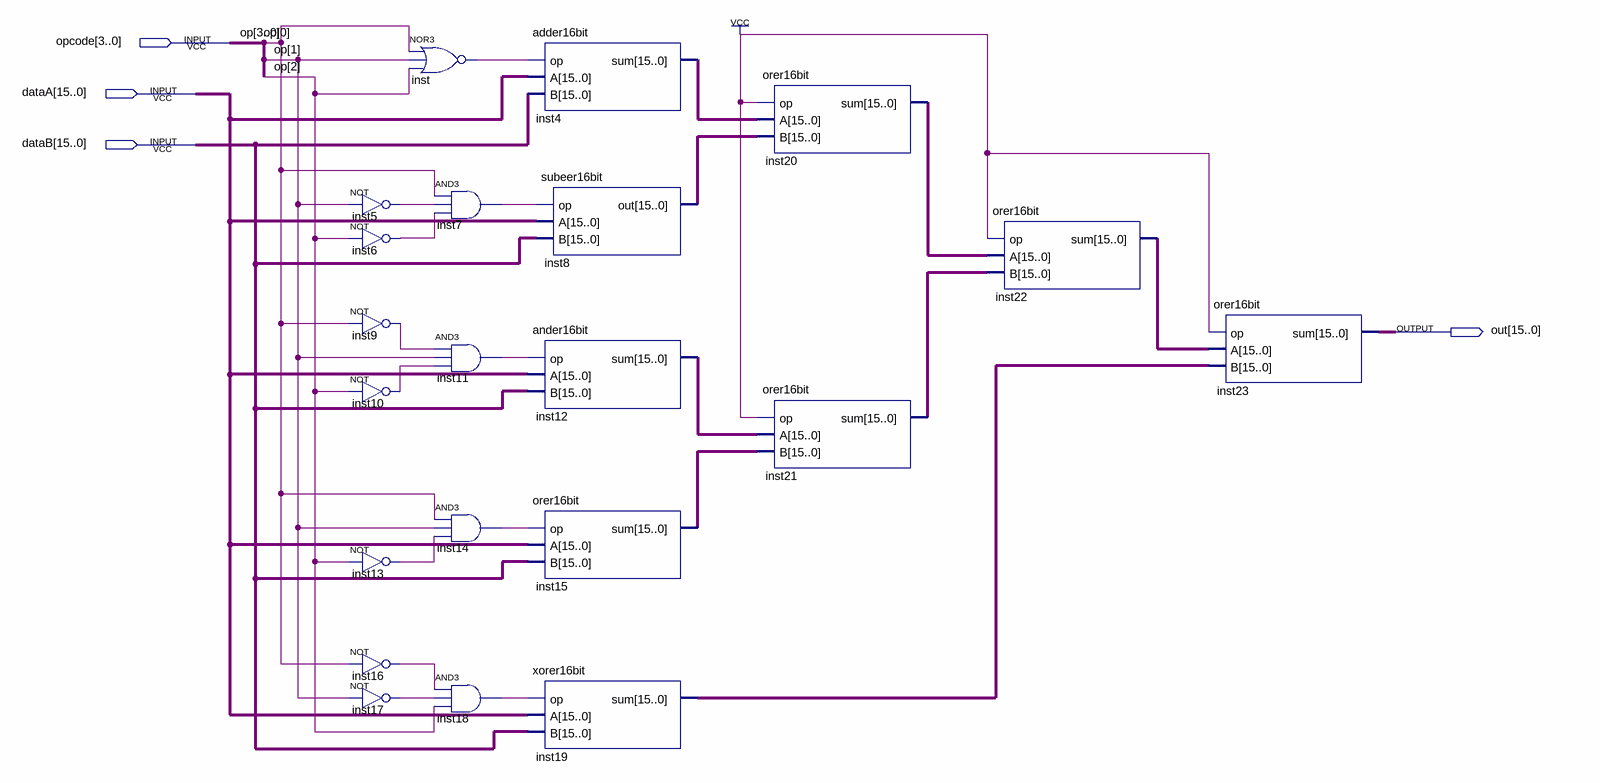
[diagram p0: schematic sheet]
// Quartus schematic ALU.bdf as structural Verilog: 21 symbols, 4 pins
module ALU (
  input  [3:0] opcode,
  input  [15:0] dataA,
  input  [15:0] dataB,
  output [15:0] out
);

  wire inst5_out, inst6_out, inst7_out, inst9_out, inst10_out, inst11_out, inst13_out, inst14_out,
       inst16_out, inst17_out, inst18_out, inst_out;
  wire [15:0] inst4_sum, inst8_out, inst12_sum, inst15_sum, inst19_sum, inst20_sum, inst21_sum, inst22_sum;

  not inst5 (inst5_out, opcode[1]);
  not inst6 (inst6_out, opcode[2]);
  not inst9 (inst9_out, opcode[0]);
  not inst10 (inst10_out, opcode[2]);
  not inst13 (inst13_out, opcode[2]);
  not inst16 (inst16_out, opcode[0]);
  not inst17 (inst17_out, opcode[1]);
  nor inst (inst_out, opcode[0], opcode[1], opcode[2]);
  and inst7 (inst7_out, opcode[0], inst5_out, inst6_out);
  and inst11 (inst11_out, inst9_out, opcode[1], inst10_out);
  and inst14 (inst14_out, opcode[0], opcode[1], inst13_out);
  and inst18 (inst18_out, inst16_out, inst17_out, opcode[2]);
  adder16bit inst4 (.op(inst_out), .A(dataA), .B(dataB), .sum(inst4_sum));
  subeer16bit inst8 (.op(inst7_out), .A(dataA), .B(dataB), .out(inst8_out));
  ander16bit inst12 (.op(inst11_out), .A(dataA), .B(dataB), .sum(inst12_sum));
  orer16bit inst15 (.op(inst14_out), .A(dataA), .B(dataB), .sum(inst15_sum));
  xorer16bit inst19 (.op(inst18_out), .A(dataA), .B(dataB), .sum(inst19_sum));
  orer16bit inst20 (.op(1'b1), .A(inst4_sum), .B(inst8_out), .sum(inst20_sum));
  orer16bit inst21 (.op(1'b1), .A(inst12_sum), .B(inst15_sum), .sum(inst21_sum));
  orer16bit inst22 (.op(1'b1), .A(inst20_sum), .B(inst21_sum), .sum(inst22_sum));
  orer16bit inst23 (.op(1'b1), .A(inst22_sum), .B(inst19_sum), .sum(out));

  // Other names for the same wires on the sheet: op[3:0] = opcode
endmodule
